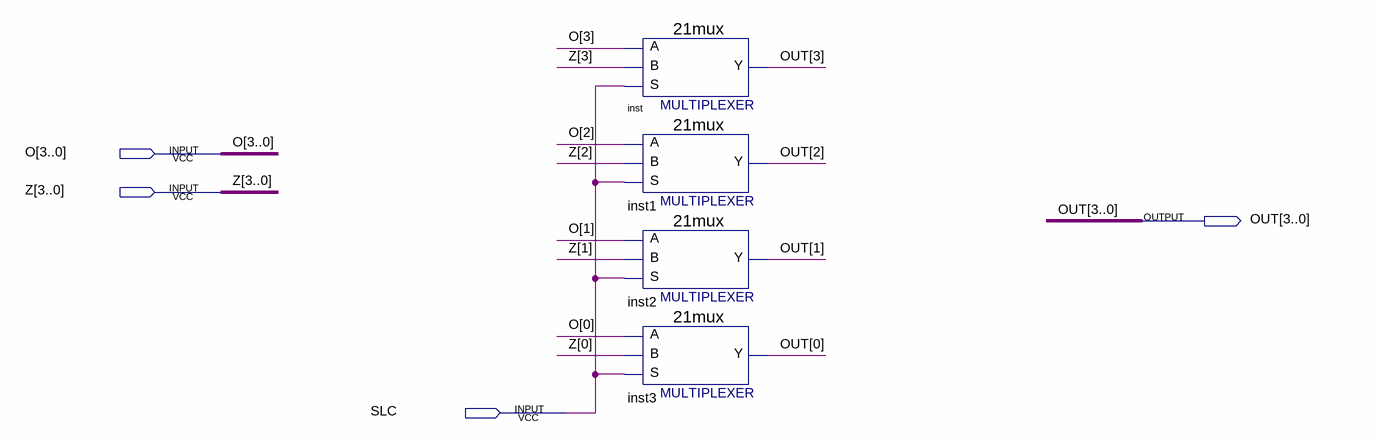
[diagram p0: schematic sheet]
// Quartus schematic MUX_BUS_4.bdf as structural Verilog: 4 symbols, 4 pins
module MUX_BUS_4 (
  input  [3:0] O,
  input  [3:0] Z,
  input  SLC,
  output [3:0] OUT
);

  \21mux  inst (.S(SLC), .B(Z[3]), .A(O[3]), .Y(OUT[3]));
  \21mux  inst1 (.S(SLC), .B(Z[2]), .A(O[2]), .Y(OUT[2]));
  \21mux  inst2 (.S(SLC), .B(Z[1]), .A(O[1]), .Y(OUT[1]));
  \21mux  inst3 (.S(SLC), .B(Z[0]), .A(O[0]), .Y(OUT[0]));
endmodule
